# Altium project Pmod_Usb_Rcb_M2.PrjPcb
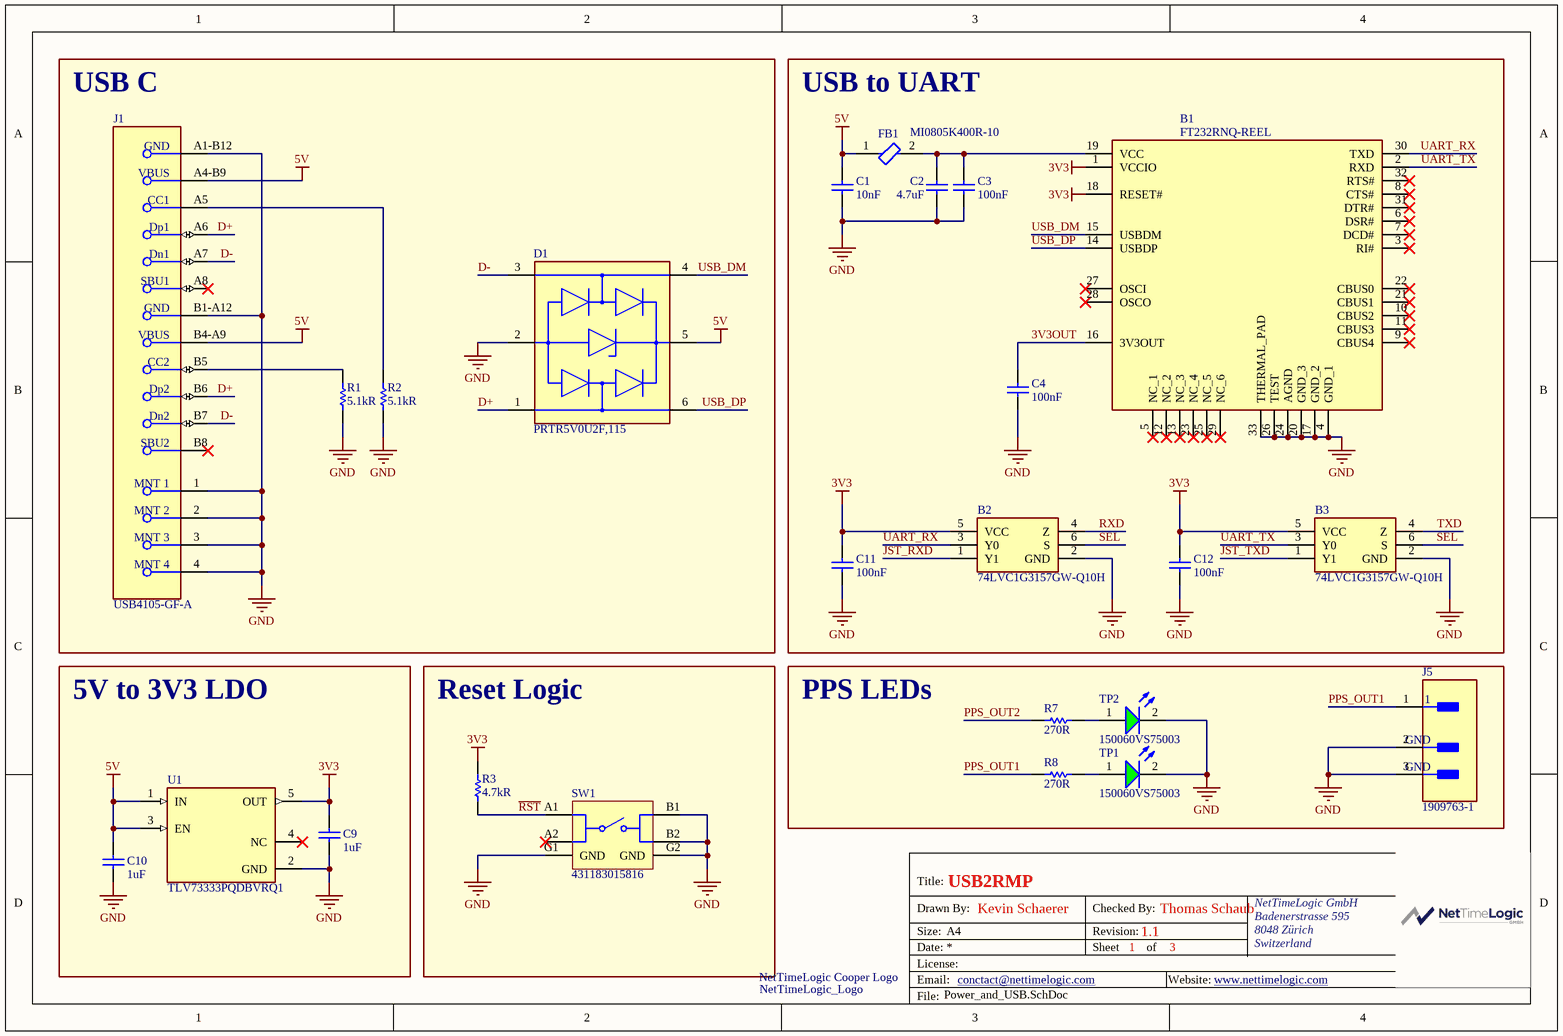
[diagram p0: Power_and_USB.SchDoc]
3 sheets, 48 parts. Net scope: global (net labels, ports and power ports of the same name join across sheets).
Board file: Pmod_Usb_Rcb_M2.PcbDoc
Sheets:
  Power_and_USB.SchDoc
  Connectors.SchDoc
  Mechanical.SchDoc

## Sheet Power_and_USB.SchDoc: USB2RMP
size A4; CheckedBy: Thomas Schaub; DrawnBy: Kevin Schaerer; Revision: 1.1; SheetNumber: 1; SheetTotal: 3; SPICEModelCacheFNSAIBAK: <root> / <DocumentId>FNSAIBAK</DocumentId> / </root>

### Parts
1  NetTimeLogic_Logo  [NetTimeLogic_Logo_25mm]  (no BOM)
B1  FT232RNQ-REEL  [QFN50P500X500X90-33N-D]
B2  74LVC1G3157GW-Q10H  [SOT65P210X110-6N]
B3  74LVC1G3157GW-Q10H  [SOT65P210X110-6N]
C1  value 10nF  [FP-C0603C-CF-MFG]  (hidden comment: C0603C103K5RACTU)
C2  value 4.7uF  [CAPC1608X90X35LL15T15]  (hidden comment: C0603C475M9PACTU)
C3  value 100nF  [FP-C0603C-CF-MFG]  (hidden comment: C0603C104K4RACTU)
C4  value 100nF  [FP-C0603C-CF-MFG]  (hidden comment: C0603C104K4RACTU)
C9  value 1uF  [CAPC1608X90X35LL15T15]  (hidden comment: C0603C105K4RACTU)
C10  value 1uF  [CAPC1608X90X35LL15T15]  (hidden comment: C0603C105K4RACTU)
C11  value 100nF  [FP-C0603C-CF-MFG]  (hidden comment: C0603C104K4RACTU)
C12  value 100nF  [FP-C0603C-CF-MFG]  (hidden comment: C0603C104K4RACTU)
D1  PRTR5V0U2F,115  [FP-SOT886-MFG]
FB1  MI0805K400R-10  [FP-MI0805-MFG]
J1  USB4105-GF-A  [FP-USB4105-GF-A-MFG]
J5  1909763-1  [FP-1909763-1-MFG]
R1  value 5.1kR  [RESC1608X55X25LL10T15]  (hidden comment: RC0603FR-075K1L)
R2  value 5.1kR  [RESC1608X55X25LL10T15]  (hidden comment: RC0603FR-075K1L)
R3  value 4.7kR  [RESC1608X55X25LL10T15]  (hidden comment: RC0603FR-074K7L)
R7  value 270R  [RESC1608X55X25LL10T15]  (hidden comment: RC0603FR-07270RL)
R8  value 270R  [RESC1608X55X25LL10T15]  (hidden comment: RC0603FR-07270RL)
SW1  431183015816  [WS-TASV_L5W5H1.5_4311x30158x6]
TP1  150060VS75003  [WL-SMCW_0603_150060xx75003]
TP2  150060VS75003  [WL-SMCW_0603_150060xx75003]
U1  TLV73333PQDBVRQ1  [FP-DBV0005A-MFG]

### Blocks framed on the sheet
USB C: D1 J1 R1 R2
USB to UART: B1-B3 C1-C4 C11 C12 FB1
5V to 3V3 LDO: C9 C10 U1
Reset Logic: R3 SW1
PPS LEDs: J5 R7 R8 TP1 TP2

### Nets
3V3: B1.1(VCCIO) B1.18(RESET#) B2.5(VCC) B3.5(VCC) C9.2 C11.2 C12.2 R3.1 U1.5(OUT)
5V: C1.2 C10.2 D1.5(VCC) FB1.1 J1.A4-B9(VBUS) J1.B4-A9(VBUS) U1.1(IN) U1.3(EN)
GND: B1.4(GND_1) B1.17(GND_2) B1.20(GND_3) B1.24(AGND) B1.26(TEST) B1.33(THERMAL_PAD) B2.2(GND) B3.2(GND) C1.1 C2.1 C3.1 C4.1 C9.1 C10.1 C11.1 C12.1 D1.2(GND) J1.1(MNT_1) J1.2(MNT_2) J1.3(MNT_3) J1.4(MNT_4) J1.A1-B12(GND) J1.B1-A12(GND) J5.2(GND) J5.3(GND) R1.1 R2.1 SW1.B1 SW1.B2 SW1.G1(GND) SW1.G2(GND) TP1.2(K) TP2.2(K) U1.2(GND)
3V3OUT: B1.16(3V3OUT) C4.2
~{RST}: R3.2 SW1.A1
D+: D1.1(I/O1) J1.A6(Dp1) J1.B6(Dp2)
D-: D1.3(I/O2) J1.A7(Dn1) J1.B7(Dn2)
JST_RXD: B2.1(Y1)
JST_TXD: B3.1(Y1)
PPS_OUT1: J5.1 R8.1
PPS_OUT2: R7.1
RXD: B2.4(Z)
SEL: B2.6(S) B3.6(S)
TXD: B3.4(Z)
UART_RX: B1.30(TXD) B2.3(Y0)
UART_TX: B1.2(RXD) B3.3(Y0)
USB_DM: B1.15(USBDM) D1.4(I/O2)
USB_DP: B1.14(USBDP) D1.6(I/O1)
NetB1_19: B1.19(VCC) C2.2 C3.2 FB1.2
NetJ1_A5: J1.A5(CC1) R2.2
NetJ1_B5: J1.B5(CC2) R1.2
NetR7_2: R7.2 TP2.1(A)
NetR8_2: R8.2 TP1.1(A)

Not connected (* = marked no-connect by the designer): B1 3(RI#)* 5(NC_1)* 6(DSR#)* 7(DCD#)* 8(CTS#)* 9(CBUS4)* 10(CBUS2)* 11(CBUS3)* 12(NC_2)* 13(NC_3)* 21(CBUS1)* 22(CBUS0)* 23(NC_4)* 25(NC_5)* 27(OSCI)* 28(OSCO)* 29(NC_6)* 31(DTR#)* 32(RTS#)*; J1 A8(SBU1)* B8(SBU2)*; SW1 A2*; U1 4(NC)*

### Notes on the sheet
- Title:
- Drawn By:
- Checked By:
- NetTimeLogic GmbH
- Badenerstrasse 595
- Size:
- Date:
- File:
- License:
- Email:
- A4
- conctact@nettimelogic.com <mailto:contact@nettimelogic.com>
- Revision:
- Sheet
- of
- Website:
- www.nettimelogic.com <http://www.nettimelogic.com>
- 8048 Zürich
- Switzerland
- (in symbol CMP-00016-12) NetTimeLogic Cooper Logo

### Library data of the parts
1 = CMP-00016-12: NetTimeLogic Cooper Logos 15mm,  25mm, 35mm, 50 mm
B1 = CMP-183-000000-5: UART Interface IC USB Full Speed to Serial UART IC, Includes Oscillator and EEPROM, QFN-32; Manufacturer_Name: FTDI Chip; Geometry.Height: 0.9mm; Manufacturer_Part_Number: FT232RNQ-REEL; Source: FT232RNQ-REEL.SchLib; Design Item ID: FT232RNQ-REEL; Datasheet Link: https://www.mouser.de/datasheet/2/163/DS_FT232RN-3011324.pdf; Mouser Part Number: 895-FT232RNQ-REEL; Mouser Price/Stock: https://www.mouser.co.uk/ProductDetail/FTDI/FT232RNQ-REEL?qs=By6Nw2ByBD2sZBqAeYrE8Q%3D%3D
B2 B3 = CMP-193-000000-4: 74LVC1G3157-Q100 - 2-channel analog multiplexer/demultiplexer@en-us; Manufacturer_Name: Nexperia; Geometry.Height: 1.1mm; Manufacturer_Part_Number: 74LVC1G3157GW-Q10H; Design Item ID: 74LVC1G3157GW-Q10H; Datasheet Link: https://assets.nexperia.com/documents/data-sheet/74LVC1G3157_Q100.pdf; Mouser Price/Stock: https://www.mouser.co.uk/ProductDetail/Nexperia/74LVC1G3157GW-Q10H?qs=5XOdhvmYM0OEi4hrMRn80A%3D%3D; Source: 74LVC1G3157GW-Q10H.SchLib; Mouser Part Number: 771-74LVC1G3157GWQ10
C1 = CMP-00068-12: CAP CER 10000PF 50V X7R 0603; Tolerance: 10%; Dissipation Factor: 2.5%; Dielectric: X7R; Series: C0603C; Case/Package: 0603; Height: 0.8mm; Construction: Flat; Depth: 0.8mm; Packaging: Tape and Reel; Reach SVHC Compliant: No; Package Quantity: 4000; RoHS Compliant: Yes; Radiation Hardening: No; Width: 0.8mm; Voltage Rating (DC): 50V; Mounting Technology: PCB,Surface Mount; Max Operating Temperature: 125°C; Termination: SMD/SMT; Min Operating Temperature: -55°C; Length: 1.6mm; Lead Pitch: 0.7mm; Case Code (Metric): 1608; Voltage: 50V; Voltage Rating: 50V; Case Code (Imperial): 0603; Pins: 2
C2 = CMP-00091-2: Cap Ceramic 4.7uF 6.3V X5R 20% SMD 0603 85C Paper T/R; Dissipation Factor: 5%; Packaging: Tape and Reel; Tolerance: 20%; Min Operating Temperature: -55°C; Dielectric: X5R; Termination: SMD/SMT; Lead Pitch: 0.7mm; Voltage Rating (DC): 6.3V; Depth: 0.8mm; Case Code (Imperial): 0603; Package Quantity: 4000; Length: 1.6mm; Lead Free: Lead Free; Case Code (Metric): 1608; Series: SMD Comm X5R; Thickness: 0.034inch; Radiation Hardening: No; Max Operating Temperature: 85°C; Construction: Flat; Width: 0.8mm; Height: 0.8mm; Case/Package: 0603; Mounting Technology: Surface Mount; RoHS Compliant: Yes; Reach SVHC Compliant: No; Dielectric Material: Ceramic; Voltage Rating: 6.3V
C3 C4 C11 C12 = CMP-00009-15: Cap Ceramic 0.1uF 16V X7R 10% SMD 0603 125°C Paper T/R; Dissipation Factor: 3.5%; Voltage Rating (DC): 16V; Reach SVHC Compliant: Yes; Contact Plating: Tin,Matte; Mounting Technology: Surface Mount,PCB; Depth: 0.8mm; Length: 1.6mm; Min Operating Temperature: -55°C; Dielectric Material: Ceramic; Termination: SMD/SMT; Dielectric: X7R; Pins: 2; Thickness: 0.034inch; Voltage Rating: 16V; Packaging: Tape and Reel; Lead Pitch: 0.7mm; Weight: 7.1E-05oz; Height: 0.8mm; Voltage: 16V; Tolerance: 10%; Width: 0.8mm; Case Code (Imperial): 0603; Case/Package: 0603; Construction: Flat; Max Operating Temperature: 125°C; Package Quantity: 4000; Series: SMD Comm X7R; Case Code (Metric): 1608; Radiation Hardening: No
C9 C10 = CMP-00012-8: Cap Ceramic 1uF 16V X7R 10% SMD 0603 125°C Paper T/R; Dissipation Factor: 3.5%; Case/Package: 0603; Min Operating Temperature: -55°C; Tolerance: 10%; Voltage Rating (DC): 16V; Voltage Rating: 16V; Dielectric: X7R; RoHS Compliant: Yes; Radiation Hardening: No; Height: 0.8mm; Case Code (Imperial): 0603; Mounting Technology: Surface Mount,PCB; Construction: Flat; Max Operating Temperature: 125°C; Series: SMD Comm X7R; Reach SVHC Compliant: Yes; Depth: 0.8mm; Packaging: Tape and Reel; Width: 0.8mm; Length: 1.6mm; Thickness: 0.034inch; Termination: SMD/SMT; Contact Plating: Tin,Matte; Dielectric Material: Ceramic; Pins: 2; Voltage: 16V; Package Quantity: 4000; Case Code (Metric): 1608
D1 = CMP-00051-7: TVS DIODE 5.5VWM SOT886; RoHS Compliant: Yes
FB1 = CMP-00154-2: Ferrite Chip, 1 Function(s), 1.5A, 2 Pin(s); Output Impedance: 40R; Channels: 1; DC Resistance-Max: 50mR; Height: 0.9mm; Manufacturer Series: MI0805K400R; Width: 1.25mm; Max Operating Temperature: 125°C; Filter Type: FERRITE CHIP; RoHS Compliant: Yes; Current Rating: 1.5A; JESD-609 Code: e3; Packaging: Tape and Reel; Length: 2mm; Mounting Technology: Surface Mount; Terminal Finish: Tin; Min Operating Temperature: -55°C
J1 = CMP-002-00010-4: Conn USB 2.0 Type C RCP 24 POS 0.3mm/0.5mm Solder RA SMD 24 Terminal 1 Port T/R
J5 = CMP-002-00011-2: RF COAX Connector, UMCC PLUG, 50 OHM, PCB; Co; Connector Type: UMCC Coaxial; Body Style: Straight
R1 R2 = CMP-009-00031-1: SMD Chip Resistor, 5.1 kOhm, ± 1%, 100 mW, 0603 [1608 Metric], Thick Film, General Purpose; Voltage Rating: 50V; Power Rating: 100mW; Temperature Coefficient: 100ppm/°C; Max Power Dissipation: 100mW; Resistance Tolerance: 1%; Pins: 2; RoHS Compliant: Yes; Length: 0.063inch; Resistor Type: Thick Film; Depth: 0.8mm; Voltage Rating (DC): 50V; Width: 0.031inch; Case/Package: 0603; Case Code (Metric): 1608; Tolerance: 1%; Packaging: Tape and Reel; Height: 0.022inch; Features: Moisture Resistant; Package Quantity: 1; Min Operating Temperature: -55°C; Lead Pitch: 0.3mm; Lead Free: Lead Free; Termination: SMD/SMT; Max Operating Temperature: 155°C; Series: RC; Military Standard: Not; Construction: Rectangular; Number of Terminations: 2; Reach SVHC Compliant: No; Case Code (Imperial): 0603
R3 = CMP-00024-6: Res Thick Film 0603 4.7K Ohm 1% 1/10W ±100ppm/°C Molded SMD Paper T/R; Power Rating: 100mW; Voltage Rating: 50V; Number of Terminations: 2; Features: Moisture Resistant; Resistance Tolerance: 1%; Series: RC; Width: 0.8mm; Case Code (Metric): 1608; Military Standard: Not; Termination: SMD/SMT; Lead Free: Lead Free; Packaging: Tape and Reel; RoHS Compliant: Yes; Max Operating Temperature: 155°C; Construction: Rectangular; Case/Package: 0603; Height: 0.45mm; Case Code (Imperial): 0603; Lead Pitch: 0.3mm; Resistor Type: Thick Film; Max Power Dissipation: 100mW; Pins: 2; Voltage Rating (DC): 50V; Tolerance: 1%; Length: 1.6mm; Depth: 0.8mm; Min Operating Temperature: -55°C; Temperature Coefficient: 100ppm/°C
R7 R8 = CMP-009-00018-6: SMD Chip Resistor, 270 Ohm, ± 1%, 100 mW, 0603 [1608 Metric], Thick Film, General Purpose; Power Rating: 100mW; Temperature Coefficient: 100ppm/°C; Voltage Rating: 50V; Number of Terminations: 2; Series: RC; Resistor Type: Thick Film; Depth: 0.8mm; Weight: 7.1E-05oz; Technology: THICK FILM; Max Power Dissipation: 100mW; Case Code (Metric): 1608; RoHS Compliant: Yes; Length: 0.063inch; Packaging: Tape and Reel; Termination: SMD/SMT; Features: Moisture Resistant; Case Code (Imperial): 0603; Package Quantity: 5000; Max Operating Temperature: 155°C; Lead Free: Lead Free; Height: 0.022inch; Width: 0.031inch; Voltage Rating (DC): 50V; Tolerance: 1%; Min Operating Temperature: -55°C; Construction: Rectangular; Pins: 2; Military Standard: Not; Case/Package: 0603; Reach SVHC Compliant: Unknown; Lead Pitch: 0.3mm; Resistance Tolerance: 1%
SW1 = CMP-00161-1: Switch Tactile Spst-no 0.02A 15V; Insulation Resistance: 100MR; Throw Configuration: SPST; Actuator Type: Standard; Actuator Material: Polymer,Liquid Crystal Polymer; Mechanical Life: 1000000Cycles; Illumination Type: Non-Illuminated,Illuminated; Operating Force: 160gf; Actuator Length: 0.3mm; Current Rating: 50mA; Switch Function: Off-Mom; Switch Travel: 0.25mm; Contact Current Rating: 20mA; Contact Material: Stainless Steel,Steel; Contact Type: 1 maker; Width: 5mm; Reach SVHC Compliant: No; Length: 5mm; Mounting Technology: Surface Mount; Max Operating Temperature: 85°C; Contact Resistance: 100mR; RoHS Compliant: Yes; Series: WS-TASV; Termination: Solder; Packaging: Cut Tape; Min Operating Temperature: -40°C; Height: 1.5mm
TP1 TP2 = CMP-00137-8: Led, Bright Green, 100Mcd, 572Nm Rohs Compliant: Yes; Forward Voltage: 2V; Forward Current: 20mA; Height: 0.7mm; Case/Package: 0603; Color: Green; Pins: 2; Case Code (Imperial): 0603; Mounting Technology: Surface Mount; Max Operating Temperature: 100°C; Component Type: LED; Min Operating Temperature: -40°C; Case Code (Metric): 1608
U1 = CMP-181-000003-1: Automotive 300-mA, low-IQ, low-dropout voltage regulator with enable 5-SOT-23 -40 to 125

## Sheet Connectors.SchDoc: USB2RMP
size A4; Date: *******; ApprovedBy: *******; CheckedBy: Thomas Schaub; Author: *******; CompanyName: *******; DrawnBy: Kevin Schaerer; Engineer: *******; Organization: *******; Address1: *******; Address2: *******; Address3: *******; Address4: *******; DocumentNumber: Doc Num; Revision: 1.1; SheetNumber: 2; SheetTotal: 3; CurrentTime: *******; CurrentDate: *******; Time: *******; DocumentFullPathAndName: *******; DocumentName: *******; ModifiedDate: *******; ImagePath: *******; ProjectName: *******; Application_BuildNumber: *******
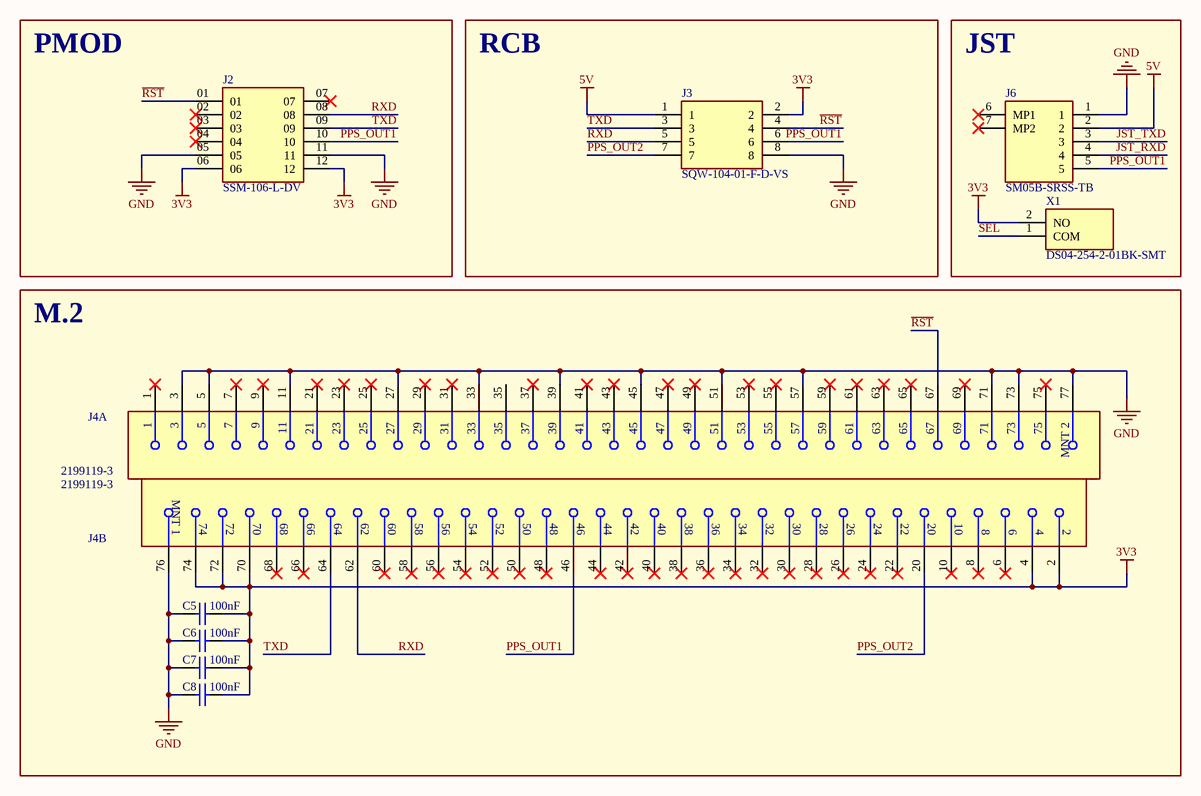
[diagram p1: Connectors.SchDoc]

### Parts
C5  value 100nF  [FP-C0603C-CF-MFG]  (hidden comment: C0603C104K4RACTU)
C6  value 100nF  [FP-C0603C-CF-MFG]  (hidden comment: C0603C104K4RACTU)
C7  value 100nF  [FP-C0603C-CF-MFG]  (hidden comment: C0603C104K4RACTU)
C8  value 100nF  [FP-C0603C-CF-MFG]  (hidden comment: C0603C104K4RACTU)
J2  SSM-106-L-DV  [SAMTEC_SSM-106-L-DV]
J3  SQW-104-01-F-D-VS  [SAMTEC-SQW-104-01-X-D-VS]
J4  2199119-3  [FP-2199119-3-MFG]  (parts A,B of 2)
J6  SM05B-SRSS-TB  [SM05BSRSSTBLFSN]
X1  DS04-254-2-01BK-SMT  [DS04254201BKSMTTR]

### Blocks framed on the sheet
PMOD: J2
RCB: J3
JST: J6 X1
M.2: C5-C8 J4

### Nets
3V3: C5.2 C6.2 C7.2 C8.2 J2.06 J2.12 J3.2 J4.2 J4.4 J4.70 J4.72 J4.74 X1.2(NO)
5V: J3.1 J6.2
GND: C5.1 C6.1 C7.1 C8.1 J2.05 J2.11 J3.8 J4.3 J4.5 J4.11 J4.27 J4.33 J4.39 J4.45 J4.51 J4.57 J4.71 J4.73 J4.76(MNT_1) J4.77(MNT_2) J6.1
~{RST}: J2.01 J3.4 J4.67
JST_RXD: J6.4
JST_TXD: J6.3
PPS_OUT1: J2.10 J3.6 J4.46 J6.5
PPS_OUT2: J3.7 J4.20
RXD: J2.08 J3.5 J4.62
SEL: X1.1(COM)
TXD: J2.09 J3.3 J4.64

Not connected (* = marked no-connect by the designer): J2 02* 03* 04* 07*; J4 1* 6* 7* 8* 9* 10* 21* 22* 23* 24* 25* 26* 28* 29* 30* 31* 32* 34* 35 36* 37* 38* 40* 41* 42* 43* 44* 47* 48* 49* 50* 52* 53* 54* 55* 56* 58* 59* 60* 61* 63* 65* 66* 68* 69* 75*; J6 6(MP1)* 7(MP2)*

### Notes on the sheet
- Title:
- Drawn By:
- Checked By:
- NetTimeLogic GmbH
- Badenerstrasse 595
- Size:
- Date:
- File:
- License:
- Email:
- A4
- conctact@nettimelogic.com <mailto:contact@nettimelogic.com>
- Revision:
- Sheet
- of
- Website:
- www.nettimelogic.com <http://www.nettimelogic.com>
- 8048 Zürich
- Switzerland

### Library data of the parts
C5-C8 = CMP-00009-15: as C3 on sheet Power_and_USB; Contact Plating: Tin,Matte; Radiation Hardening: No; Max Operating Temperature: 125°C; Package Quantity: 4000; Voltage: 16V; Thickness: 0.034inch; Case Code (Metric): 1608; Length: 1.6mm; Voltage Rating: 16V; Case/Package: 0603; Packaging: Tape and Reel; Depth: 0.8mm; Reach SVHC Compliant: Yes; Tolerance: 10%; Case Code (Imperial): 0603; Pins: 2; Dielectric Material: Ceramic; Series: SMD Comm X7R; Voltage Rating (DC): 16V; Dielectric: X7R; Width: 0.8mm; Lead Pitch: 0.7mm; Mounting Technology: Surface Mount,PCB; Min Operating Temperature: -55°C; Weight: 7.1E-05oz; Construction: Flat; Height: 0.8mm; Termination: SMD/SMT
J2 = CMP-020-000000-6: Header Surface Mount (2.54mm) 2x6; MF: Samtec; Package: None; MP: SSM-106-L-DV; Value: *; Design Item ID: SSM-106-L-DV; Pin Count: 12; Component Type: Standard; Availability: Unavailable; Price: None; Source: SSM-106-L-DV.SchLib
J3 = CMP-199-000000-4: Headers & Wire Housings Cost Effective Rugged PCB Sockets, 2.00mm pitch; Price: None; Source: SAMTEC-SQW-104-01-X-D-VS.SchLib; MP: SAMTEC-SQW-104-01-X-D-VS; Component Type: Standard; Value: *; Design Item ID: SAMTEC-SQW-104-01-X-D-VS; Availability: Unavailable; Pin Count: 8; Package: None
J4 = CMP-002-00009-1: Conn Card Edge SKT 67 POS 0.5mm Solder RA SMD Embossed T/R
J6 = CMP-244-000000-2: Board Connector, 5 Contact(s), 1 Row(s), Male, Right Angle, Surface Mount Terminal; Manufacturer_Name: JST (JAPAN SOLDERLESS TERMINALS); Manufacturer_Part_Number: SM05B-SRSS-TB(LF)(SN); Voltage Rating: 50V; Pitch: 0.039inch; Number of Positions: 5; Contact Resistance: 40mR; Connector Type: Header; Max Current Rating: 1A; Insulation Resistance: 100MR; Geometry.Height: 2.95mm; Gender: Male; Min Operating Temperature: -25°C; Termination: Solder; Length: 7mm; Depth: 4.95mm; Series: SR; Mouser Part Number: *; Packaging: Cut Tape; Lead Free: Contains Lead; Contact Type: Male Pin; Contact Finish - Mating: TIN; Design Item ID: SM05B-SRSS-TB_LF__SN_; Orientation: Right Angle; Color: Natural; Mouser Price/Stock: *; Mounting Technology: Surface Mount; Contact Shape: Square; Housing Color: Natural; Datasheet Link: http://www.jst-mfg.com/product/pdf/eng/eSH.pdf; Material: Polyamide; Flammability Rating: UL94 V-0; Source: SM05B-SRSS-TB_LF__SN_.SchLib; Contact Material: Copper Alloy; Housing Material: Nylon; Number of Contacts: 5; Voltage Rating (AC): 50V; Max Voltage Rating (AC): 50V; Package Quantity: 1; Reach SVHC Compliant: No; Lead Pitch: 1mm; Insulation Color: Natural; Max Voltage Rating (DC): 50V; Fastening Type: Pull; Max Operating Temperature: 85°C; Current Rating: 1A; Number of Rows: 1; Insulation Material: Nylon; Contact Plating: Tin,Lead
X1 = CMP-247-000000-2: Switch DIP OFF ON SPST 1 Flat Slide 0.025A 24VDC Gull Wing 2.54mm SMD Tube; Manufacturer_Name: Same Sky; Voltage Rating (DC): 24V; Washable: No; Body Material: PBT,Polybutylene; Actuator Type: Slide (Standard); Switching Current: 25mA; Number of Positions: 1; Electrical Life: 2000Cycles; Geometry.Height: 4.3mm; Height: 3.66mm; Length: 3.54mm; Series: DS04-254-SMT; Contact Plating: Gold; Mouser Part Number: 490-DS04254201BK-STR; Switching Voltage: 24V; Source: DS04-254-2-01BK-SMT-TR.SchLib; Manufacturer_Part_Number: DS04-254-2-01BK-SMT-TR; Mouser Price/Stock: https://www.mouser.co.uk/ProductDetail/CUI-Devices/DS04-254-2-01BK-SMT-TR?qs=wnTfsH77Xs4xXRFXKF0ssg%3D%3D; Pitch: 2.54mm; Width: 6.2mm; Datasheet Link: https://www.cuidevices.com/product/resource/supplyframepdf/ds04-254-smt.pdf; Min Operating Temperature: -40°C; Max Operating Temperature: 85°C; Contact Material: Copper Alloy; Design Item ID: DS04-254-2-01BK-SMT-TR; Termination: Gull Wing; Throw Configuration: SPST; Mounting Technology: Surface Mount

## Sheet Mechanical.SchDoc: USB2RMP
size A4; Date: *******; ApprovedBy: *******; CheckedBy: Thomas Schaub; Author: *******; CompanyName: *******; DrawnBy: Kevin Schaerer; Engineer: *******; Organization: *******; Address1: *******; Address2: *******; Address3: *******; Address4: *******; DocumentNumber: Doc Num; Revision: 1.1; SheetNumber: 3; SheetTotal: 3; CurrentTime: *******; CurrentDate: *******; Time: *******; DocumentFullPathAndName: *******; DocumentName: *******; ModifiedDate: *******; ImagePath: *******; ProjectName: *******; Application_BuildNumber: *******
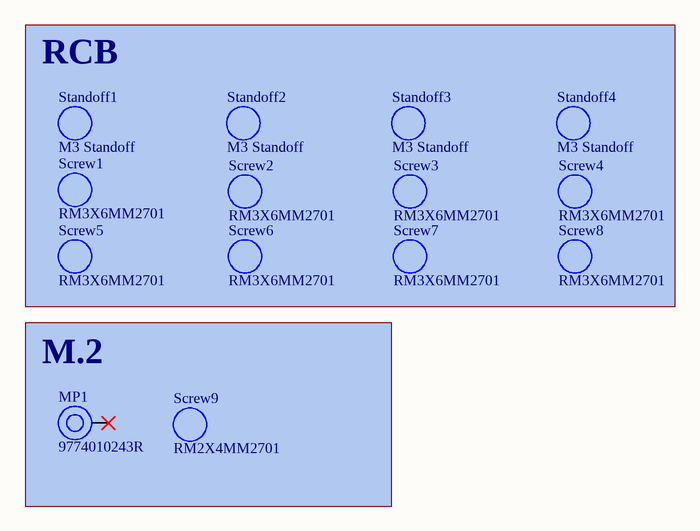
[diagram p2: Mechanical.SchDoc]

### Parts
MP1  9774010243R  [9774010243]
Screw1  RM3X6MM2701  (no BOM)
Screw2  RM3X6MM2701  (no BOM)
Screw3  RM3X6MM2701  (no BOM)
Screw4  RM3X6MM2701  (no BOM)
Screw5  RM3X6MM2701  (no BOM)
Screw6  RM3X6MM2701  (no BOM)
Screw7  RM3X6MM2701  (no BOM)
Screw8  RM3X6MM2701  (no BOM)
Screw9  RM2X4MM2701  (no BOM)
Standoff1  M3 Standoff  (no BOM)
Standoff2  M3 Standoff  (no BOM)
Standoff3  M3 Standoff  (no BOM)
Standoff4  M3 Standoff  (no BOM)

### Blocks framed on the sheet
RCB: Screw1-Screw8 Standoff1-Standoff4
M.2: MP1 Screw9

### Nets

Not connected (* = marked no-connect by the designer): MP1 1*

### Notes on the sheet
- Title:
- Drawn By:
- Checked By:
- NetTimeLogic GmbH
- Badenerstrasse 595
- Size:
- Date:
- File:
- License:
- Email:
- A4
- conctact@nettimelogic.com <mailto:contact@nettimelogic.com>
- Revision:
- Sheet
- of
- Website:
- www.nettimelogic.com <http://www.nettimelogic.com>
- 8048 Zürich
- Switzerland

### Library data of the parts
MP1 = CMP-082-000049-2: WA-SMSI SMT Steel Spacer with internal Thread, OD 4.35mm, M2 x 1mm; Manufacturer: Wurth Elektronik; Inside Diameter: 2.8mm; Surface: Tin; Design Item ID: 9774010243R; Match Code: WA-SMSI; Source: WA-SMSI.SchLib; Operating Temperature Min: -55°C; Outside Diameter: 4.35mm; Material: Steel; ComponentLink1Description: Website Link; Pin Count: 1; Component Type: Standard; Packaging: Tape and Reel; ComponentLink2URL: https://www.we-online.com/redexpert/spec/9774010243R?ad; Manufacturer Part Number: 9774010243R; ComponentLink2Description: Datasheet Link; Category: SMT Spacers; ComponentLink1URL: https://www.we-online.com/redexpert/article/9774010243R?ad; Operating Temperature Max: 150°C; Height: 1mm; Mount: Surface Mount; Thread Size: M2
Screw1-Screw8 = CMP-00028-00002-1: Hardware;  Metric phillips pan head seelskrew M3 thd 6mm long with silicone oring; Series: SEELSKREW®; Mounting Technology: Screw; Length: 0.24inch; Material: Stainless Steel; Thread Size: M3
Screw9 = CMP-00028-00003-1: Hardware; Metric phillips pan head seelskrew M2 thd 4mm long with silicone oring; Series: SEELSKREW®; Material: Stainless Steel; Thread Size: M2; Mounting Technology: Hardware; Length: 0.157inch
Standoff1-Standoff4 = CMP-00028-00001-2: Standoff, 5mm Hex, Female, Threaded M3, Length 10mm, Brass/Nickel; Body Plating: Nickel; Gender: Female, Female; Reach SVHC Compliant: No; Shape: Hex; Threaded/Unthreaded: Threaded; Thread Size: M3; Mounting Technology: External; Size: 0.197inch; Width: 5mm; Lead Free: Lead Free; Body Length: 10mm; Length: 10mm; Plating: Nickel; Material: Brass; Package Quantity: 10; Series: -; Color: Natural; Outside Diameter: 5mm

## Nets that join several sheets
3V3: Power_and_USB (9 pins), Connectors (13 pins)
5V: Power_and_USB (8 pins), Connectors (J3.1 J6.2)
GND: Power_and_USB (34 pins), Connectors (21 pins)
~{RST}: Power_and_USB (R3.2 SW1.A1), Connectors (J2.01 J3.4 J4.67)
JST_RXD: Power_and_USB (B2.1), Connectors (J6.4)
JST_TXD: Power_and_USB (B3.1), Connectors (J6.3)
PPS_OUT1: Power_and_USB (J5.1 R8.1), Connectors (J2.10 J3.6 J4.46 J6.5)
PPS_OUT2: Power_and_USB (R7.1), Connectors (J3.7 J4.20)
RXD: Power_and_USB (B2.4), Connectors (J2.08 J3.5 J4.62)
SEL: Power_and_USB (B2.6 B3.6), Connectors (X1.1)
TXD: Power_and_USB (B3.4), Connectors (J2.09 J3.3 J4.64)